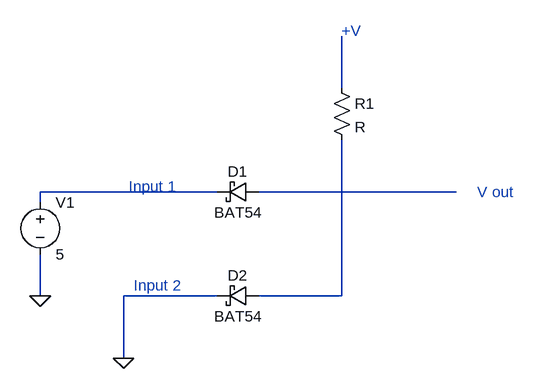
[diagram p0: schematic AND gate.asc]
AND gate.asc, the LTspice schematic file:
Version 4
SHEET 1 880 680
WIRE 208 64 208 -16
WIRE 16 224 -256 224
WIRE 384 224 80 224
WIRE -256 240 -256 224
WIRE -256 384 -256 320
WIRE 16 384 -128 384
WIRE 208 384 208 144
WIRE 208 384 80 384
WIRE -128 480 -128 384
FLAG -256 384 0
FLAG -128 480 0
SYMBOL res 192 48 R0
SYMATTR InstName R1
SYMBOL schottky 80 208 R90
WINDOW 0 0 32 VBottom 2
WINDOW 3 32 32 VTop 2
SYMATTR InstName D1
SYMATTR Value BAT54
SYMBOL schottky 80 368 R90
WINDOW 0 0 32 VBottom 2
WINDOW 3 32 32 VTop 2
SYMATTR InstName D2
SYMATTR Value BAT54
SYMBOL voltage -256 224 R0
WINDOW 123 0 0 Left 0
WINDOW 39 0 0 Left 0
SYMATTR InstName V1
SYMATTR Value 5
TEXT 208 -24 Left 2 ;+V
TEXT 416 224 Left 2 ;V out
TEXT -120 216 Left 2 ;Input 1
TEXT -112 368 Left 2 ;Input 2

The netlist it stands for:
* AND gate.asc
R1 N001 N004 R
D1 N003 N002 BAT54
D2 N004 0 BAT54
V1 N002 0 5
.model D D
.lib standard.dio
* +V
* V out
* Input 1
* Input 2
.backanno
.end